# Altium schematic sheet System.SchDoc
size A2; PageSetup: Record=PageOptions|CenterHorizontal=True|CenterVertical=True|PrintScale=1.00|XCorrection=1.00|YCorrection=1.00|PrintKind=1|BorderSize=5000000|LeftOffset=0|BottomOffset=0|Orientation=1|PaperLength=1000|PaperWidth=1000|Scale=100|PaperSource=7|PrintQuality=-4|MediaType=1|DitherType=10|PaperKind=A3|PrintScaleMode=1
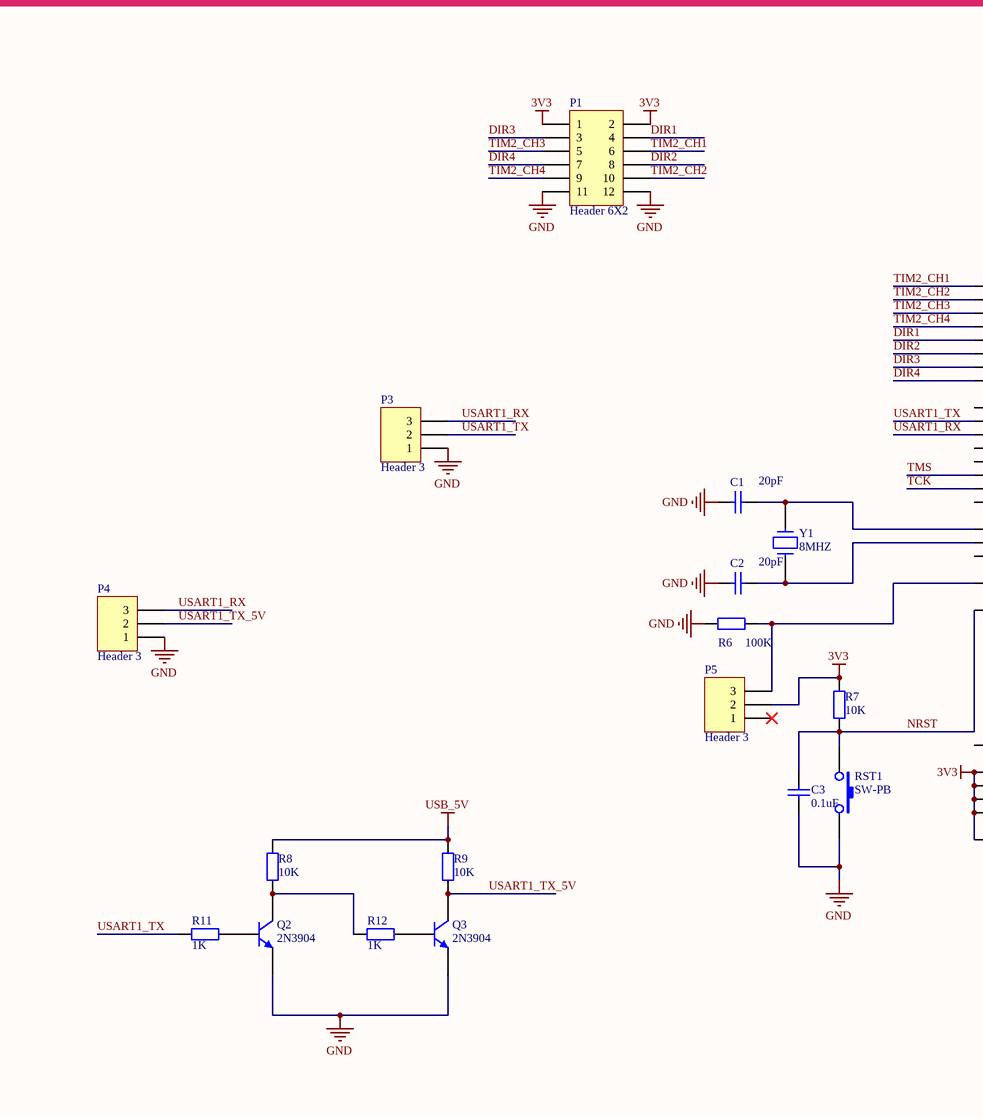
[diagram p0: System.SchDoc, left]
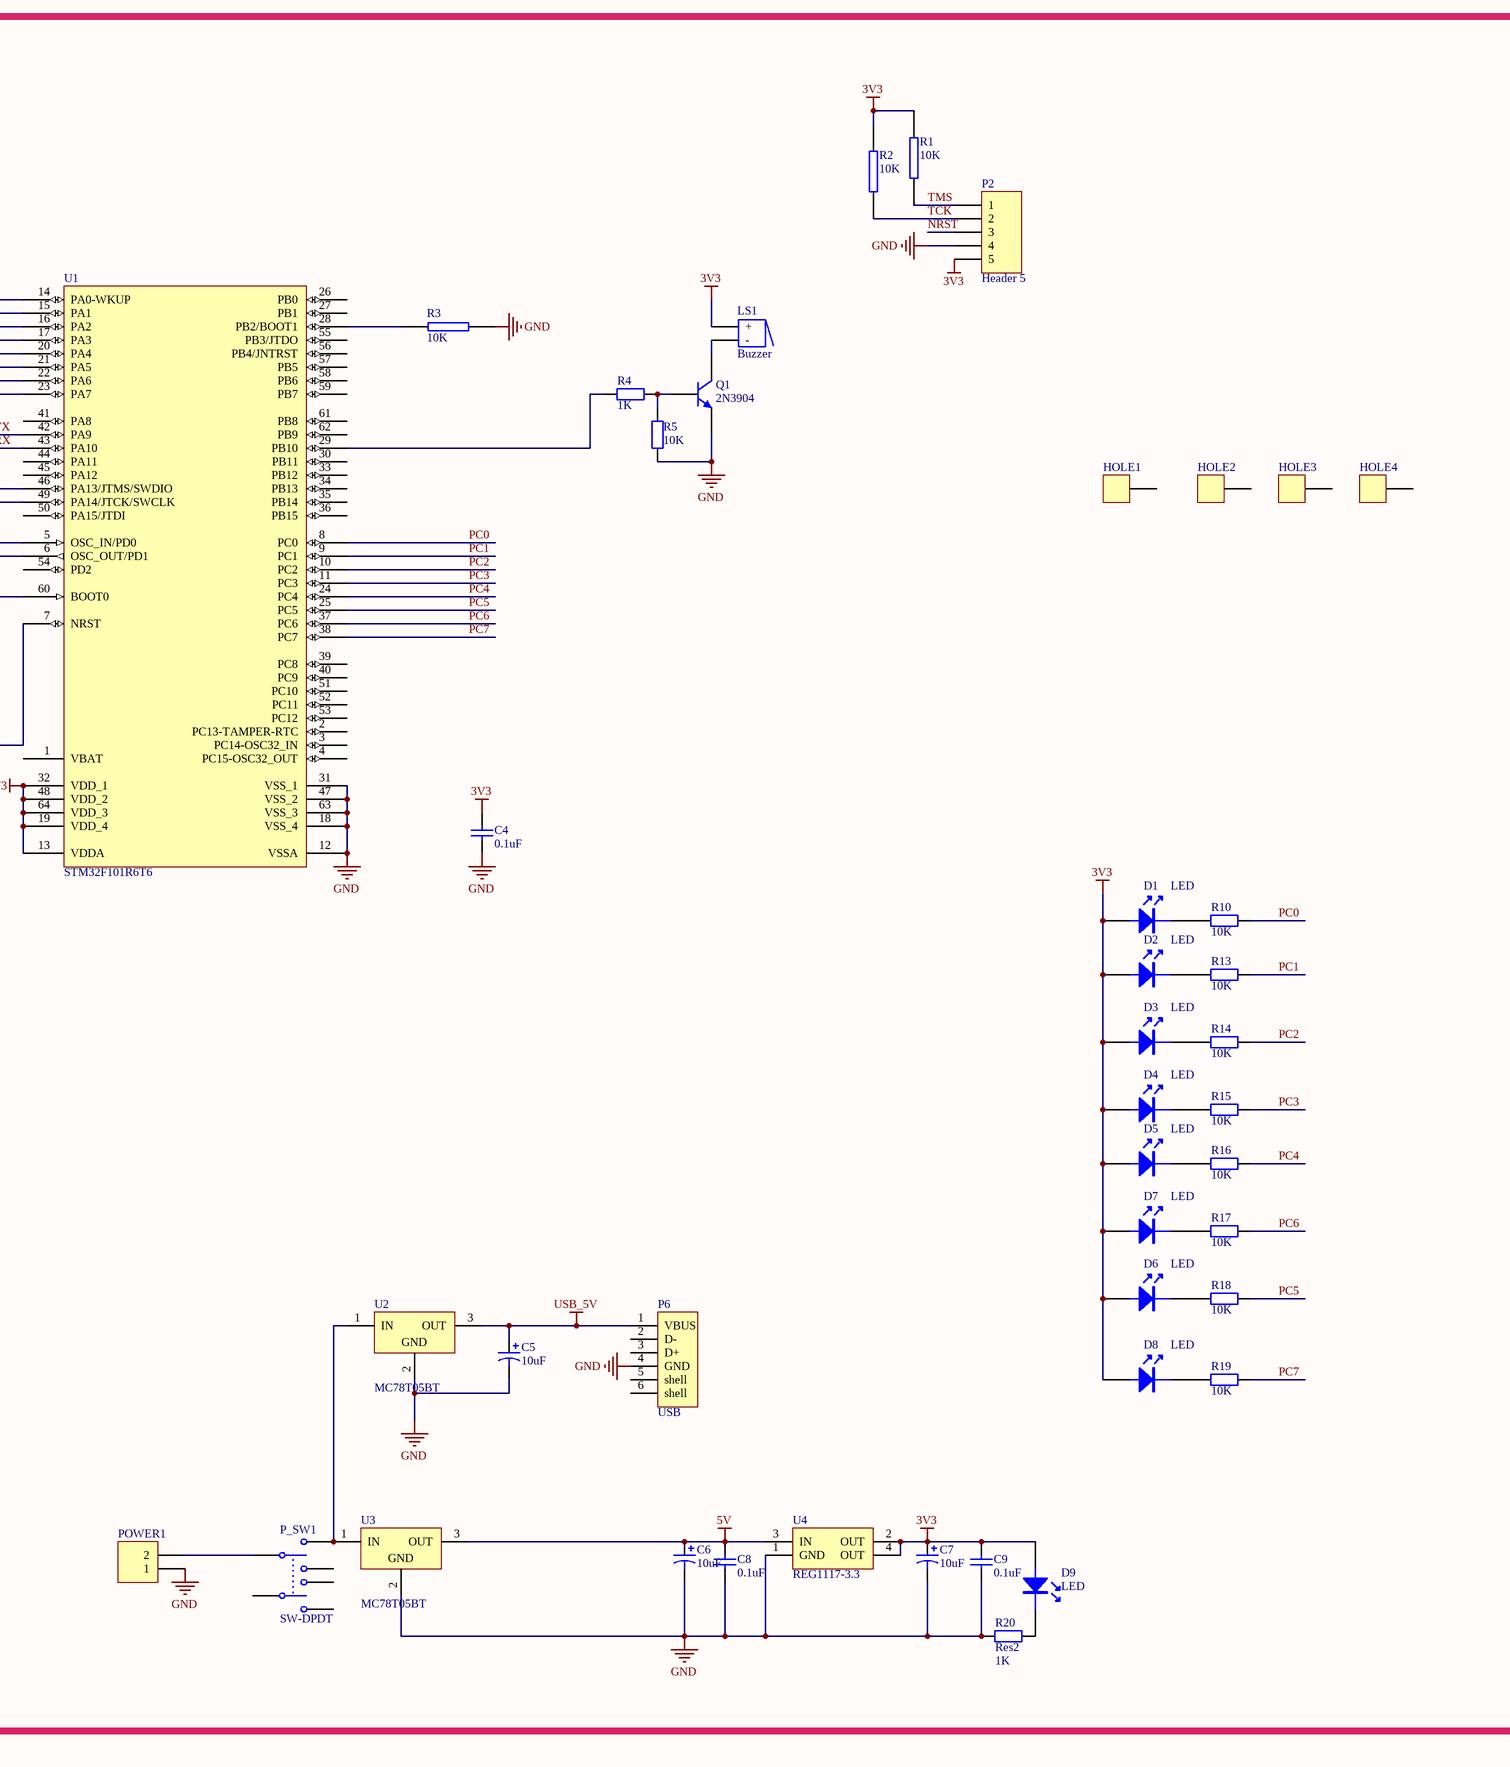
[diagram p1: System.SchDoc, right]

## Parts
C1  value 20pF  [SMDC0805]  (hidden comment: Cap)
C2  value 20pF  [SMDC0805]  (hidden comment: Cap)
C3  value 0.1uF  [SMDC0805]  (hidden comment: Cap)
C4  value 0.1uF  [SMDC0805]  (hidden comment: Cap)
C5  value 10uF  [SMDT_C]  (hidden comment: Cap Pol1)
C6  value 10uF  [SMDT_C]  (hidden comment: Cap Pol1)
C7  value 10uF  [SMDT_C]  (hidden comment: Cap Pol1)
C8  value 0.1uF  [SMDC0805]  (hidden comment: Cap)
C9  value 0.1uF  [SMDC0805]  (hidden comment: Cap)
D1  LED  [LED_0805]
D2  LED  [LED_0805]
D3  LED  [LED_0805]
D4  LED  [LED_0805]
D5  LED  [LED_0805]
D6  LED  [LED_0805]
D7  LED  [LED_0805]
D8  LED  [LED_0805]
D9  LED  [LED_0805]
HOLE1  TP  [HOLE]  (value not drawn)
HOLE2  TP  [HOLE]  (value not drawn)
HOLE3  TP  [HOLE]  (value not drawn)
HOLE4  TP  [HOLE]  (value not drawn)
LS1  Buzzer  [Buzzer_min]
P1  Header 6X2  [HDR2X6]
P2  Header 5  [HDR1X5]
P3  Header 3  [HDR1X3]
P4  Header 3  [HDR1X3]
P5  Header 3  [HDR1X3]
P6  USB  [USB-A]
P_SW1  SW-DPDT  [PW-S]
POWER1  Header 2  [POW]  (value not drawn)
Q1  2N3904  [SOT23]
Q2  2N3904  [SOT23]
Q3  2N3904  [SOT23]
R1  10K  [SMDR0805]
R2  10K  [SMDR0805]
R3  10K  [SMDR0805]
R4  value 1K  [SMDR0805]  (hidden comment: Res2)
R5  value 10K  [SMDR0805]  (hidden comment: Res2)
R6  value 100K  [SMDR0805]  (hidden comment: Res2)
R7  value 10K  [SMDR0805]  (hidden comment: Res2)
R8  value 10K  [SMDR0805]  (hidden comment: Res2)
R9  value 10K  [SMDR0805]  (hidden comment: Res2)
R10  value 10K  [SMDR0805]  (hidden comment: Res2)
R11  value 1K  [SMDR0805]  (hidden comment: Res2)
R12  value 1K  [SMDR0805]  (hidden comment: Res2)
R13  value 10K  [SMDR0805]  (hidden comment: Res2)
R14  value 10K  [SMDR0805]  (hidden comment: Res2)
R15  value 10K  [SMDR0805]  (hidden comment: Res2)
R16  value 10K  [SMDR0805]  (hidden comment: Res2)
R17  value 10K  [SMDR0805]  (hidden comment: Res2)
R18  value 10K  [SMDR0805]  (hidden comment: Res2)
R19  value 10K  [SMDR0805]  (hidden comment: Res2)
R20  Res2  value 1K  [SMDR0805]
RST1  SW-PB  [key_2pin]
U1  STM32F101R6T6  [LQFP64_M]
U2  MC78T05BT  [MC78M05C]
U3  MC78T05BT  [MC78M05C]
U4  REG1117-3.3  [SOT-23]
Y1  8MHZ  [可换晶振]

## Nets
3V3: C4.2 C7.1 C9.2 D1.1(A) D2.1(A) D3.1(A) D4.1(A) D5.1(A) D6.1(A) D7.1(A) D8.1(A) D9.1(A) LS1.1(+) P1.1 P1.2 P2.5 P5.2 R1.1 R2.1 R7.2 U1.13(VDDA) U1.19(VDD_4) U1.32(VDD_1) U1.48(VDD_2) U1.64(VDD_3) U4.2(OUT) U4.4(OUT)
5V: C6.1 C8.2 U3.3(OUT) U4.3(IN)
GND: C1.1 C2.1 C3.1 C4.1 C5.2 C6.2 C7.2 C8.1 C9.1 P1.11 P1.12 P2.4 P3.1 P4.1 P6.4(GND) POWER1.1 Q1.2(E) Q2.2(E) Q3.2(E) R3.2 R5.1 R6.1 R20.1 RST1.2 U1.12(VSSA) U1.18(VSS_4) U1.31(VSS_1) U1.47(VSS_2) U1.63(VSS_3) U2.2(GND) U3.2(GND) U4.1(GND)
USB_5V: C5.1 P6.1(VBUS) R8.2 R9.2 U2.3(OUT)
DIR1: P1.4 U1.20(PA4)
DIR2: P1.8 U1.21(PA5)
DIR3: P1.3 U1.22(PA6)
DIR4: P1.7 U1.23(PA7)
NRST: C3.2 P2.3 R7.1 RST1.1 U1.7(NRST)
PC0: R10.1 U1.8(PC0)
PC1: R13.1 U1.9(PC1)
PC2: R14.1 U1.10(PC2)
PC3: R15.1 U1.11(PC3)
PC4: R16.1 U1.24(PC4)
PC5: R18.1 U1.25(PC5)
PC6: R17.1 U1.37(PC6)
PC7: R19.1 U1.38(PC7)
TCK: P2.2 R2.2 U1.49(PA14/JTCK/SWCLK)
TIM2_CH1: P1.6 U1.14(PA0-WKUP)
TIM2_CH2: P1.10 U1.15(PA1)
TIM2_CH3: P1.5 U1.16(PA2)
TIM2_CH4: P1.9 U1.17(PA3)
TMS: P2.1 R1.2 U1.46(PA13/JTMS/SWDIO)
USART1_RX: P3.3 P4.3 U1.43(PA10)
USART1_TX: P3.2 R11.1 U1.42(PA9)
USART1_TX_5V: P4.2 Q3.3(C) R9.1
NetC1_2: C1.2 U1.5(OSC_IN/PD0) Y1.2
NetC2_2: C2.2 U1.6(OSC_OUT/PD1) Y1.1
NetD1_2: D1.2(K) R10.2
NetD2_2: D2.2(K) R13.2
NetD3_2: D3.2(K) R14.2
NetD4_2: D4.2(K) R15.2
NetD5_2: D5.2(K) R16.2
NetD6_2: D6.2(K) R18.2
NetD7_2: D7.2(K) R17.2
NetD8_2: D8.2(K) R19.2
NetD9_2: D9.2(K) R20.2
NetLS1_2: LS1.2(-) Q1.3(C)
NetP5_3: P5.3 R6.2 U1.60(BOOT0)
NetP_SW1_1: P_SW1.1 POWER1.2
NetP_SW1_2: P_SW1.2 U2.1(IN) U3.1(IN)
NetQ1_1: Q1.1(B) R4.2 R5.2
NetQ2_1: Q2.1(B) R11.2
NetQ2_3: Q2.3(C) R8.1 R12.1
NetQ3_1: Q3.1(B) R12.2
NetR3_1: R3.1 U1.28(PB2/BOOT1)
NetR4_1: R4.1 U1.29(PB10)

Not connected (* = marked no-connect by the designer): HOLE1 1(A); HOLE2 1(A); HOLE3 1(A); HOLE4 1(A); P5 1*; P6 2(D-) 3(D+) 5(shell) 6(shell); P_SW1 3 4 5 6; U1 1(VBAT) 2(PC13-TAMPER-RTC) 3(PC14-OSC32_IN) 4(PC15-OSC32_OUT) 26(PB0) 27(PB1) 30(PB11) 33(PB12) 34(PB13) 35(PB14) 36(PB15) 39(PC8) 40(PC9) 41(PA8) 44(PA11) 45(PA12) 50(PA15/JTDI) 51(PC10) 52(PC11) 53(PC12) 54(PD2) 55(PB3/JTDO) 56(PB4/JNTRST) 57(PB5) 58(PB6) 59(PB7) 61(PB8) 62(PB9)

## Library data of the parts
C1-C4 C8 C9 = Cap: Capacitor; Published: 8-Jun-2000; LatestRevisionDate: 17-Jul-2002; LatestRevisionNote: Re-released for DXP Platform.; PackageReference: RAD-0.3; Publisher: Altium Limited; PackageDescription: Radial Cap, Thru-Hole; 2 Leads; 0.3 in Pin Spacing
C5-C7 = Cap Pol1: Polarized Capacitor (Radial); Published: 8-Jun-2000; LatestRevisionDate: 17-Jul-2002; LatestRevisionNote: Re-released for DXP Platform.; PackageReference: RB7.6-15; Publisher: Altium Limited; PackageDescription: Polarized Capacitor (Radial); 2 Leads
HOLE1-HOLE4 = TestPoint
LS1 = Buzzer: Magnetic Transducer Buzzer; Published: 24-Mar-1999; LatestRevisionDate: 17-Dec-2003; LatestRevisionNote: Schematic revised, PCB Footprint replaced.; DatasheetVersion: 17-Dec-2003; PackageReference: ABSM-1574; Publisher: Altium Limited; PackageDescription: Magnetic Transducer Buzzer; ComponentLink1Description: Manufacturer Link; ComponentLink1URL: http://www.megastar.com/linecard/buzzmode/index.php
P1 = Header 6X2: Header, 6-Pin, Dual row; LatestRevisionDate: 17-Jul-2002; LatestRevisionNote: Re-released for DXP Platform.; Publisher: Altium Limited
P2 = Header 5: Header, 5-Pin; LatestRevisionDate: 17-Jul-2002; LatestRevisionNote: Re-released for DXP Platform.; Publisher: Altium Limited
P3-P5 = Header 3: Header, 3-Pin; LatestRevisionDate: 17-Jul-2002; LatestRevisionNote: Re-released for DXP Platform.; Publisher: Altium Limited
P_SW1 = SW-DPDT: Double-Pole, Double-Throw Switch; Published: 24-Mar-1999; LatestRevisionDate: 17-Jul-2002; LatestRevisionNote: Re-released for DXP Platform.; PackageReference: DPDT-6; Publisher: Altium Limited; PackageDescription: Switch; 6 Leads
POWER1 = Header 2: Header, 2-Pin; LatestRevisionDate: 17-Jul-2002; LatestRevisionNote: Re-released for DXP Platform.; Publisher: Altium Limited
Q1-Q3 = 2N3904: NPN General Purpose Amplifier; Published: 8-Jun-2000; LatestRevisionDate: 15-Jan-2003; LatestRevisionNote: PCB Footprint 'BCY-W3/D4.7' replaced; DatasheetVersion: 1997; PackageVersion: Sep-1998; PackageReference: TO-92A; Publisher: Altium Limited; PackageDescription: TO, Flat Index; 3 In-Line, Axial Leads; Body Dia. 4.5mm; Leads 0.51 x 0.48 mm (max); ComponentLink1Description: Manufacturer Link; ComponentLink1URL: http://www.fairchildsemi.com/; ComponentLink2Description: Datasheet; ComponentLink2URL: http://www.fairchildsemi.com/ds/2N%2F2N3904.pdf
R1-R3 = RES2
R4-R20 = Res2: Resistor; Published: 8-Jun-2000; LatestRevisionDate: 17-Jul-2002; LatestRevisionNote: Re-released for DXP Platform.; PackageReference: AXIAL-0.4; Publisher: Altium Limited; PackageDescription: Axial Device, Thru-Hole; 2 Leads; 0.4 in Pin Spacing
U1 = STM32F101R6T6: STM32 ARM-based 32-bit MCU with 32 Kbytes Flash, 64-pin LQFP, Industrial Temperature; Published: 30-May-2008; DatasheetVersion: rev6, Mar-2008; PackageVersion: Mar-2008; PackageReference: LQFP64; Publisher: Altium Limited; PackageDescription: 64-Pin Low-Profile Quad Flat Pack, 10 x 10 mm Body, 0.5 mm Pitch (LQFP64); ComponentLink1Description: Manufacturer Link; ComponentLink1URL: www.st.com/stm32; ComponentLink2Description: Datasheet; ComponentLink2URL: http://www.st.com/stonline/products/literature/ds/13586.pdf
U2 U3 = MC78T05BT: Three-Ampere Positive Fixed Voltage Regulator; Note: Pin 2 is electrically connected to TAB; Published: 17-Jul-2002; DatasheetVersion: 1988; PackageReference: 221A-04; Publisher: Altium Limited; PackageDescription: TO, Thru-Hole, Vertical, Heatsink Mounted; 3 In-Line Leads; Pitch 2.54 mm; Code_JEDEC: TO-262-AA; ComponentLink1Description: Manufacturer Link; ComponentLink1URL: http://www.onsemi.com/site/products/taxonomy/0,4438,503,00.html; ComponentLink2Description: Datasheet; ComponentLink2URL: http://www.onsemi.com/pub/Collateral/MC78T00-D.PDF
U4 = REG1117-3.3: 800mA and 1A Low Dropout Positive Regulator 2.85V, 3.3V, 5V, and Adjustable; Published: *; LatestRevisionDate: *; LatestRevisionNote: *; DatasheetDocument: *; PackageDocument: *; PackageReference: *; Publisher: *; ComponentLink1Description: *; ComponentLink1URL: *
Y1 = CRYSTAL